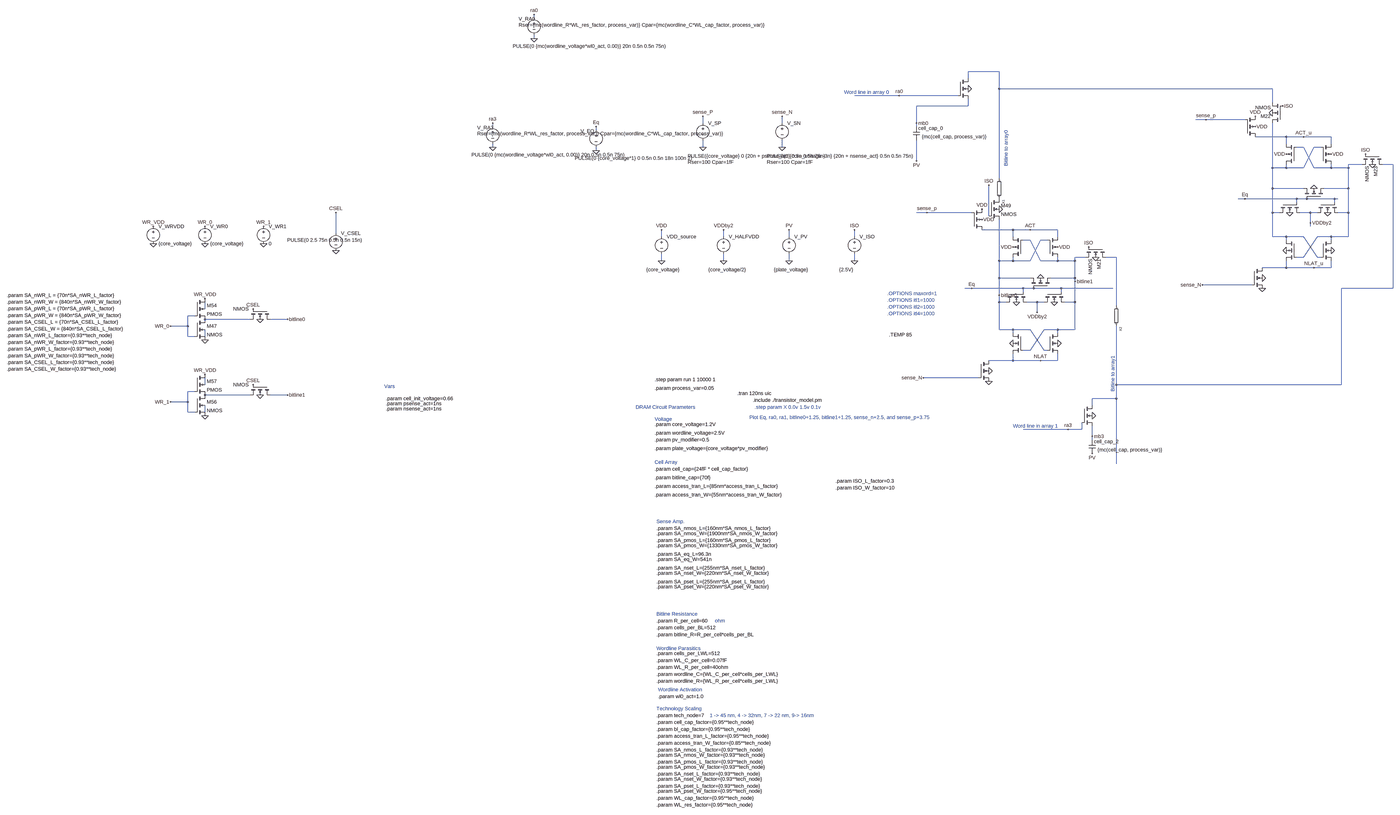
[diagram p0: schematic CLRDRAM-HP.asc, whole sheet]
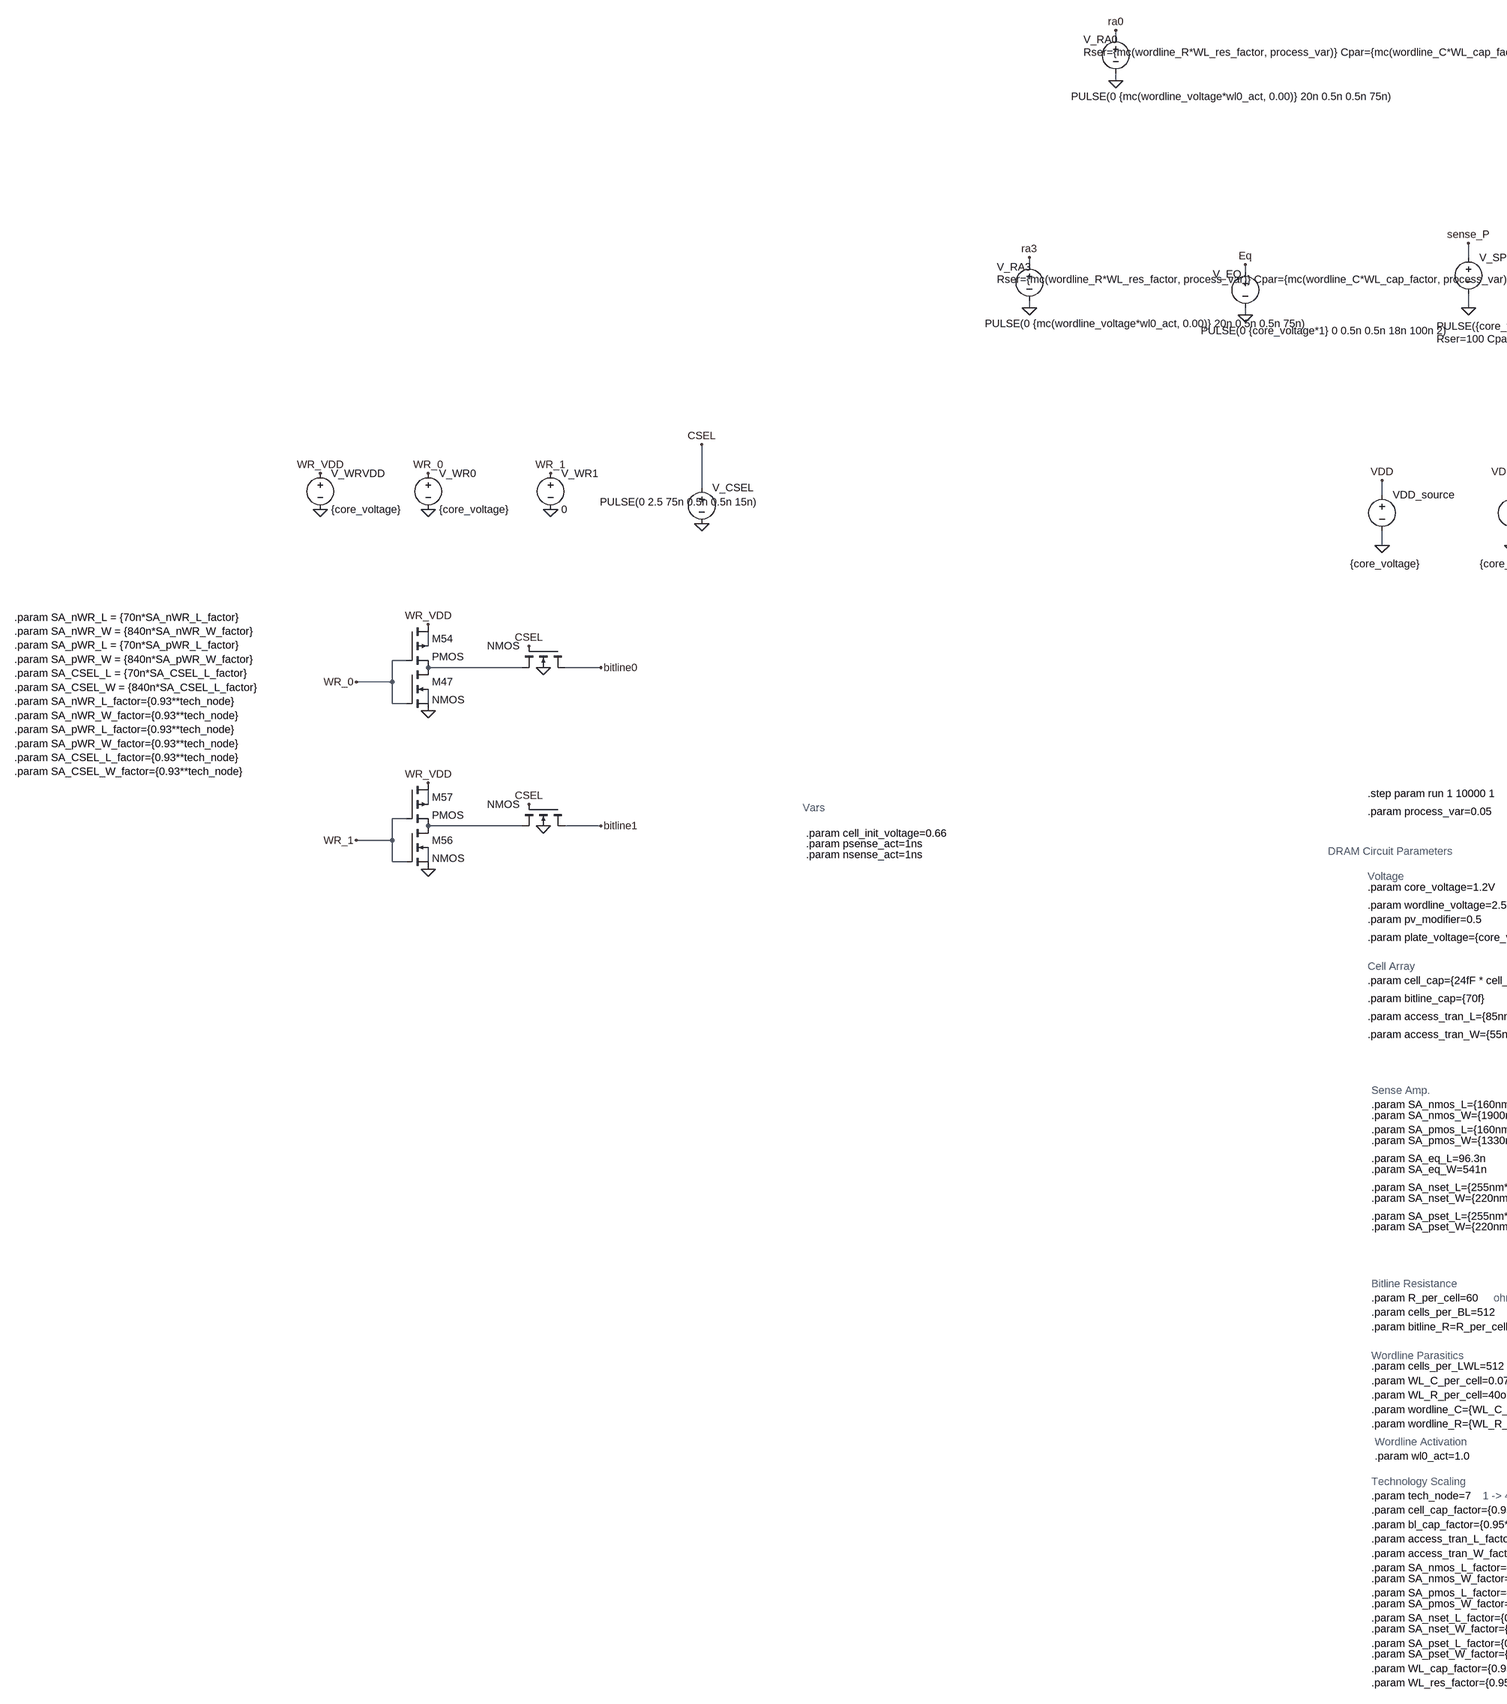
[diagram p1: schematic CLRDRAM-HP.asc, part, row 1 of 1, column 1 of 2]
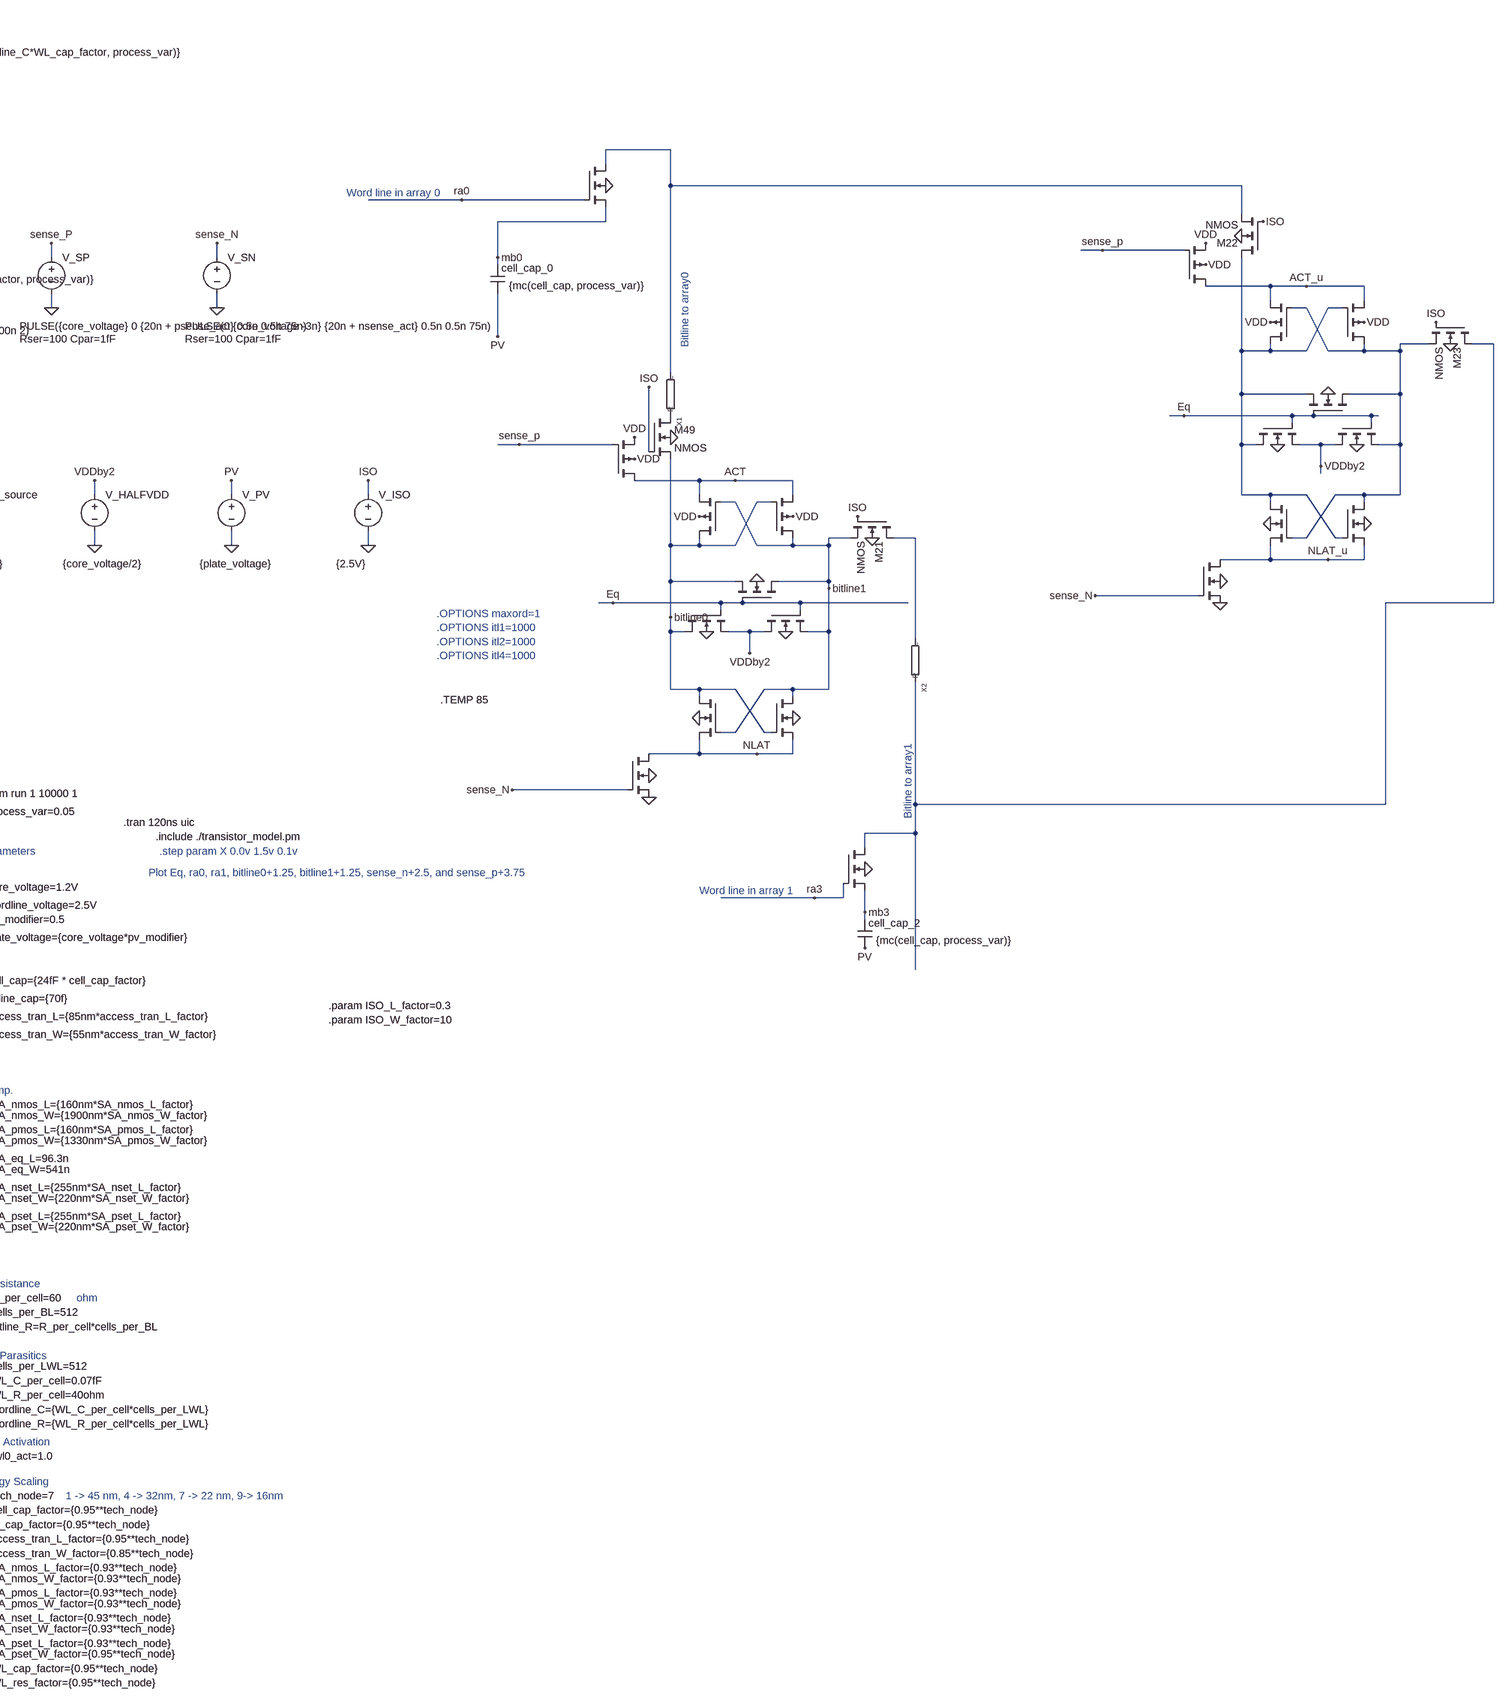
[diagram p2: schematic CLRDRAM-HP.asc, part, row 1 of 1, column 2 of 2]
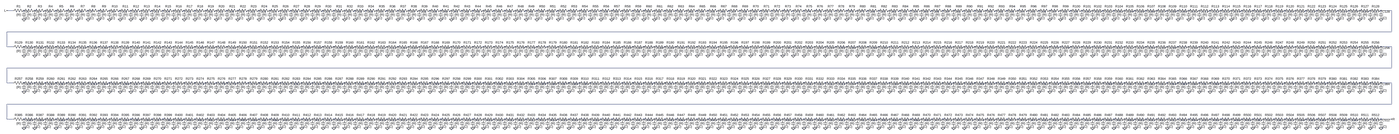
[diagram p3: sub-circuit bitline.asc, whole sheet]
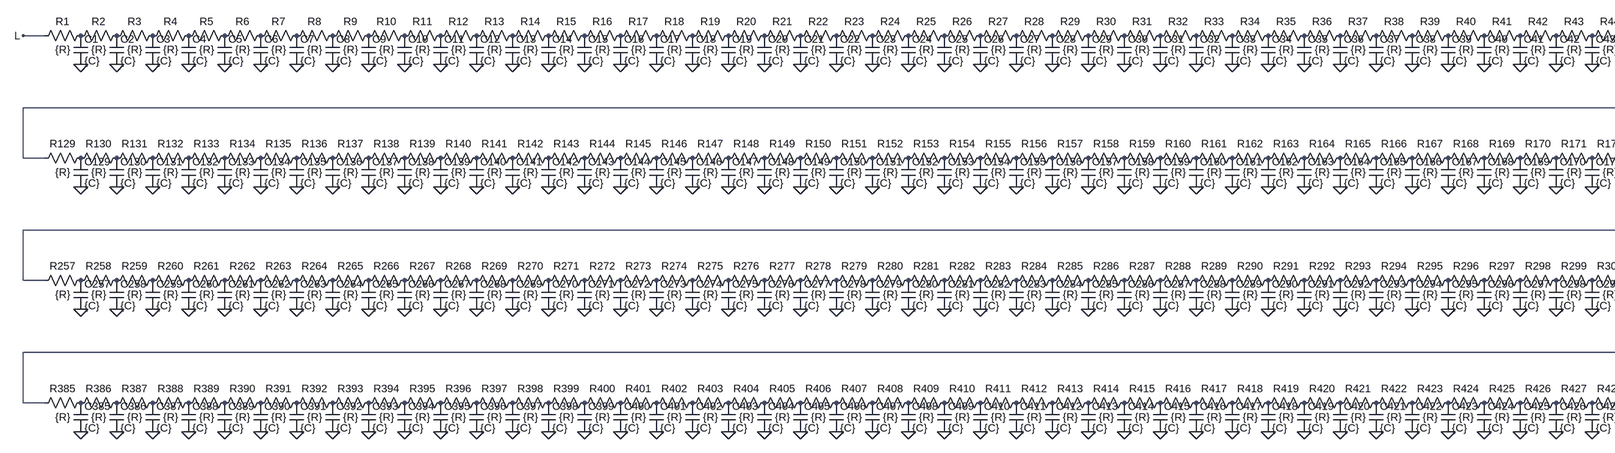
[diagram p4: sub-circuit bitline.asc, part, row 1 of 1, column 1 of 3]
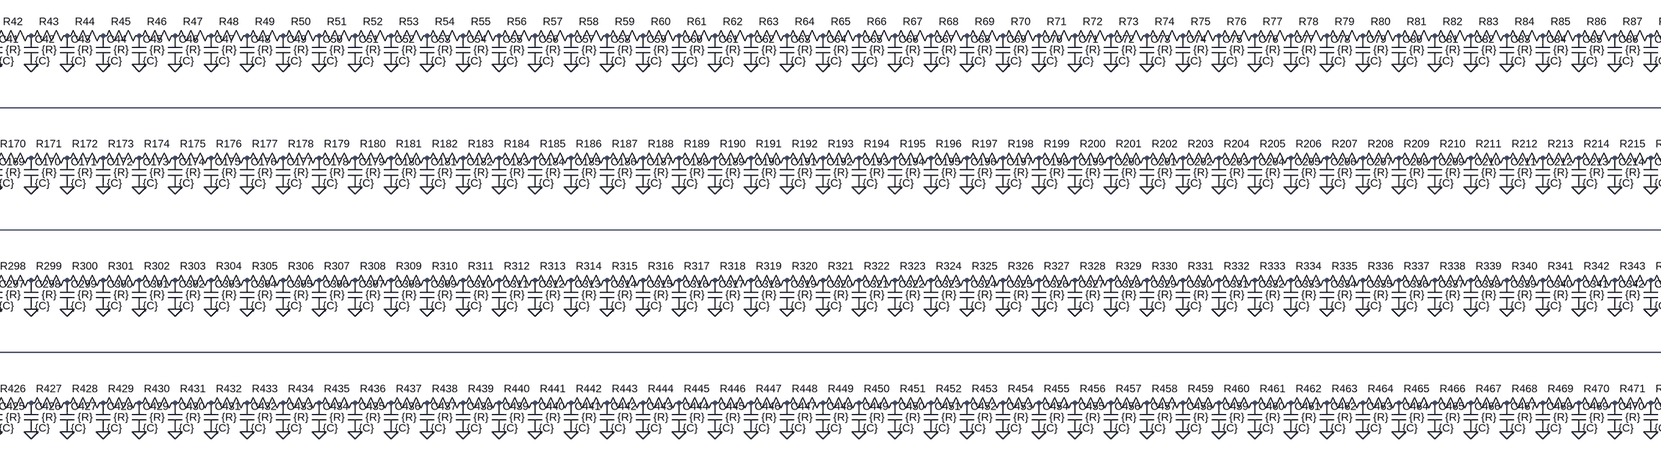
[diagram p5: sub-circuit bitline.asc, part, row 1 of 1, column 2 of 3]
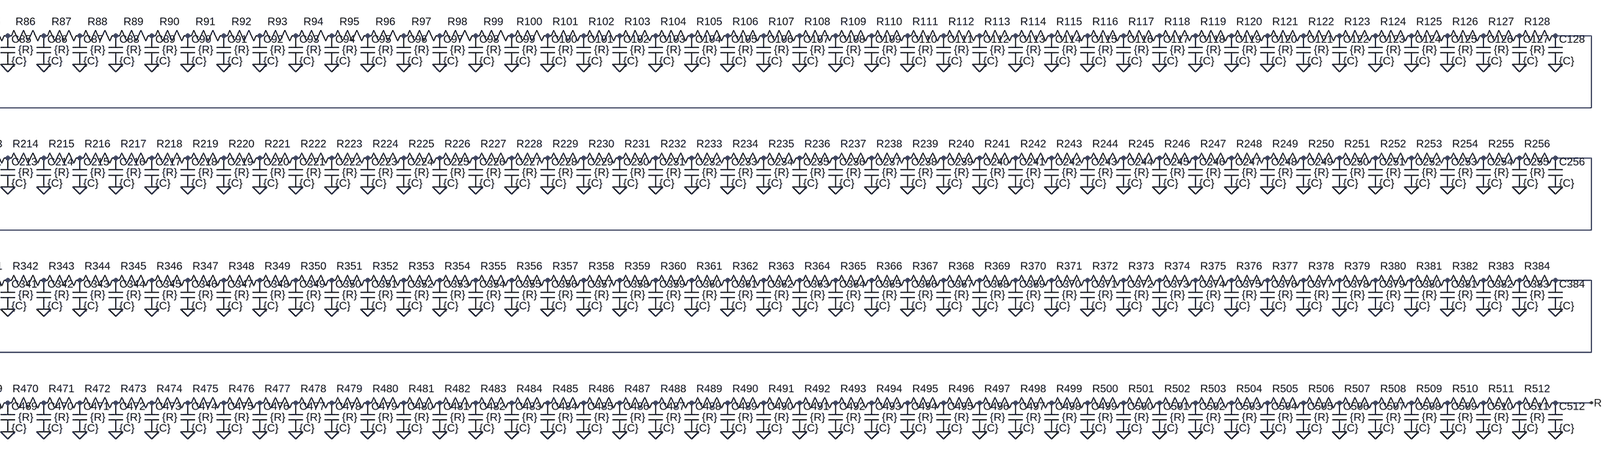
[diagram p6: sub-circuit bitline.asc, part, row 1 of 1, column 3 of 3]
CLRDRAM-HP.asc, the LTspice schematic file:
Version 4
SHEET 1 9124 2520
WIRE -1392 -1648 -1392 -1664
WIRE -1392 -1552 -1392 -1568
WIRE 768 -1392 624 -1392
WIRE 624 -1360 624 -1392
WIRE 768 -1312 768 -1392
WIRE 2064 -1312 768 -1312
WIRE 304 -1280 96 -1280
WIRE 576 -1280 304 -1280
WIRE 2064 -1248 2064 -1312
WIRE 624 -1232 624 -1264
WIRE 624 -1232 384 -1232
WIRE 1728 -1168 1680 -1168
WIRE 1936 -1168 1728 -1168
WIRE -608 -1152 -608 -1184
WIRE -240 -1152 -240 -1184
WIRE 384 -1152 384 -1232
WIRE -1584 -1136 -1584 -1152
WIRE 384 -1136 384 -1152
WIRE -1104 -1120 -1104 -1136
WIRE 2128 -1088 1984 -1088
WIRE 2208 -1088 2128 -1088
WIRE 2336 -1088 2208 -1088
WIRE 2128 -1056 2128 -1088
WIRE 2336 -1056 2336 -1088
WIRE -1584 -1040 -1584 -1056
WIRE -608 -1040 -608 -1072
WIRE -240 -1040 -240 -1072
WIRE 2208 -1040 2176 -1040
WIRE 2288 -1040 2256 -1040
WIRE -1104 -1024 -1104 -1040
WIRE 384 -976 384 -1072
WIRE 2480 -960 2416 -960
WIRE 2624 -960 2576 -960
WIRE 2064 -944 2064 -1152
WIRE 2128 -944 2128 -960
WIRE 2128 -944 2064 -944
WIRE 2208 -944 2256 -1040
WIRE 2208 -944 2128 -944
WIRE 2256 -944 2208 -1040
WIRE 2336 -944 2336 -960
WIRE 2336 -944 2256 -944
WIRE 2416 -944 2416 -960
WIRE 2416 -944 2336 -944
WIRE 768 -896 768 -1312
WIRE 2064 -848 2064 -944
WIRE 2208 -848 2064 -848
WIRE 2416 -848 2416 -944
WIRE 2416 -848 2304 -848
WIRE 1936 -800 1904 -800
WIRE 2176 -800 1936 -800
WIRE 2224 -800 2176 -800
WIRE 2352 -800 2224 -800
WIRE 2368 -800 2352 -800
WIRE 2176 -784 2176 -800
WIRE 2352 -784 2352 -800
WIRE 432 -736 384 -736
WIRE 640 -736 432 -736
WIRE 2064 -736 2064 -848
WIRE 2096 -736 2064 -736
WIRE 2240 -736 2192 -736
WIRE 2272 -736 2240 -736
WIRE 2416 -736 2416 -848
WIRE 2416 -736 2368 -736
WIRE 720 -720 720 -864
WIRE 2240 -688 2240 -736
WIRE 2240 -672 2240 -688
WIRE 832 -656 688 -656
WIRE 912 -656 832 -656
WIRE 1040 -656 912 -656
WIRE -3824 -640 -3824 -736
WIRE -800 -624 -800 -656
WIRE -512 -624 -512 -656
WIRE -208 -624 -208 -656
WIRE 96 -624 96 -656
WIRE 832 -624 832 -656
WIRE 1040 -624 1040 -656
WIRE 2064 -624 2064 -736
WIRE 2128 -624 2064 -624
WIRE 2208 -624 2128 -624
WIRE 2336 -624 2272 -624
WIRE 2416 -624 2416 -736
WIRE 2416 -624 2336 -624
WIRE 912 -608 880 -608
WIRE 992 -608 960 -608
WIRE 2128 -608 2128 -624
WIRE 2336 -608 2336 -624
WIRE 1168 -528 1120 -528
WIRE 1312 -528 1264 -528
WIRE 2208 -528 2272 -624
WIRE 2208 -528 2176 -528
WIRE 2272 -528 2208 -624
WIRE 2288 -528 2272 -528
WIRE -800 -512 -800 -544
WIRE -512 -512 -512 -544
WIRE -208 -512 -208 -544
WIRE 96 -512 96 -544
WIRE 768 -512 768 -704
WIRE 832 -512 832 -528
WIRE 832 -512 768 -512
WIRE 912 -512 960 -608
WIRE 912 -512 832 -512
WIRE 960 -512 912 -608
WIRE 1040 -512 1040 -528
WIRE 1040 -512 960 -512
WIRE 1120 -512 1120 -528
WIRE 1120 -512 1040 -512
WIRE 2128 -480 2128 -512
WIRE 2128 -480 2016 -480
WIRE 2256 -480 2128 -480
WIRE 2336 -480 2336 -512
WIRE 2336 -480 2256 -480
WIRE 768 -432 768 -512
WIRE 912 -432 768 -432
WIRE 1120 -432 1120 -512
WIRE 1120 -432 1008 -432
WIRE 1120 -416 1120 -432
WIRE 1968 -400 1712 -400
WIRE 640 -384 608 -384
WIRE 880 -384 640 -384
WIRE 928 -384 880 -384
WIRE 1056 -384 928 -384
WIRE 1296 -384 1056 -384
WIRE 2624 -384 2624 -960
WIRE 2624 -384 2384 -384
WIRE 880 -368 880 -384
WIRE 1056 -368 1056 -384
WIRE 768 -352 768 -432
WIRE 768 -320 768 -352
WIRE 800 -320 768 -320
WIRE 944 -320 896 -320
WIRE 976 -320 944 -320
WIRE 1120 -320 1120 -416
WIRE 1120 -320 1072 -320
WIRE 1312 -304 1312 -528
WIRE -4432 -288 -4432 -320
WIRE 944 -272 944 -320
WIRE -4480 -256 -4512 -256
WIRE -4224 -240 -4432 -240
WIRE -4048 -240 -4128 -240
WIRE -4512 -208 -4512 -256
WIRE -4512 -208 -4592 -208
WIRE 768 -192 768 -320
WIRE 832 -192 768 -192
WIRE 912 -192 832 -192
WIRE 1040 -192 976 -192
WIRE 1120 -192 1120 -320
WIRE 1120 -192 1040 -192
WIRE 832 -176 832 -192
WIRE 1040 -176 1040 -192
WIRE -4512 -160 -4512 -208
WIRE -4480 -160 -4512 -160
WIRE -4432 -160 -4432 -192
WIRE 912 -96 976 -192
WIRE 912 -96 880 -96
WIRE 976 -96 912 -192
WIRE 992 -96 976 -96
WIRE 832 -48 832 -80
WIRE 832 -48 720 -48
WIRE 960 -48 832 -48
WIRE 1040 -48 1040 -80
WIRE 1040 -48 960 -48
WIRE 672 32 416 32
WIRE -4432 64 -4432 32
WIRE 1312 64 1312 -208
WIRE 2384 64 2384 -384
WIRE 2384 64 1312 64
WIRE -4480 96 -4512 96
WIRE -4224 112 -4432 112
WIRE -4048 112 -4128 112
WIRE 1312 128 1312 64
WIRE 1312 128 1200 128
WIRE -4512 144 -4512 96
WIRE -4512 144 -4592 144
WIRE 1200 160 1200 128
WIRE -4512 192 -4512 144
WIRE -4480 192 -4512 192
WIRE -4432 192 -4432 160
WIRE 1088 272 880 272
WIRE 1152 272 1152 240
WIRE 1152 272 1088 272
WIRE 1200 304 1200 256
WIRE 1200 320 1200 304
WIRE 1312 432 1312 128
FLAG -1104 -1024 0
FLAG -1104 -1136 Eq
FLAG 720 0 0
FLAG -608 -1040 0
FLAG -608 -1184 sense_P
FLAG 1040 -128 0
FLAG 832 -128 0
FLAG 960 -432 0
FLAG 848 -320 0
FLAG 1024 -320 0
FLAG 640 -384 Eq
FLAG 944 -272 VDDby2
FLAG 416 32 sense_N
FLAG 720 48 0
FLAG 768 -352 bitline0
FLAG 1120 -416 bitline1
FLAG 624 -1312 0
FLAG 384 -1152 mb0
FLAG 304 -1280 ra0
FLAG 1200 208 0
FLAG 1200 304 mb3
FLAG 1088 272 ra3
FLAG -1392 -1552 0
FLAG -1392 -1664 ra0
FLAG 688 -704 VDD
FLAG 1040 -576 VDD
FLAG 832 -576 VDD
FLAG 688 -752 VDD
FLAG 432 -736 sense_p
FLAG 912 -656 ACT
FLAG 960 -48 NLAT
FLAG -240 -1040 0
FLAG -240 -1184 sense_N
FLAG -1584 -1152 ra3
FLAG -1584 -1040 0
FLAG -800 -512 0
FLAG -800 -656 VDD
FLAG -512 -512 0
FLAG -512 -656 VDDby2
FLAG 384 -976 PV
FLAG -208 -512 0
FLAG -208 -656 PV
FLAG 1200 384 PV
FLAG 2016 -432 0
FLAG 2336 -560 0
FLAG 2128 -560 0
FLAG 2256 -848 0
FLAG 2144 -736 0
FLAG 2320 -736 0
FLAG 1936 -800 Eq
FLAG 2240 -688 VDDby2
FLAG 1712 -400 sense_N
FLAG 2016 -384 0
FLAG 1984 -1136 VDD
FLAG 2336 -1008 VDD
FLAG 2128 -1008 VDD
FLAG 1984 -1184 VDD
FLAG 1728 -1168 sense_p
FLAG 2208 -1088 ACT_u
FLAG 2256 -480 NLAT_u
FLAG 96 -512 0
FLAG 96 -656 ISO
FLAG 768 -752 0
FLAG 1216 -528 0
FLAG 720 -864 ISO
FLAG 1184 -576 ISO
FLAG 2528 -960 0
FLAG 2496 -1008 ISO
FLAG 2064 -1200 0
FLAG 2112 -1232 ISO
FLAG -4432 -144 0
FLAG -4672 -592 0
FLAG -4672 -672 WR_VDD
FLAG -4432 -336 WR_VDD
FLAG -4592 -208 WR_0
FLAG -4432 -592 0
FLAG -4432 -672 WR_0
FLAG -4160 -592 0
FLAG -4160 -672 WR_1
FLAG -4176 -240 0
FLAG -4208 -288 CSEL
FLAG -4432 208 0
FLAG -4432 16 WR_VDD
FLAG -4592 144 WR_1
FLAG -4176 112 0
FLAG -4208 64 CSEL
FLAG -4048 -240 bitline0
FLAG -4048 112 bitline1
FLAG -3824 -560 0
FLAG -3824 -736 CSEL
SYMBOL nmos4 672 -48 R0
WINDOW 0 104 24 Invisible 2
WINDOW 3 179 41 Invisible 2
SYMATTR InstName M1
SYMATTR Value2 l={mc(SA_nset_L, process_var)} w={mc(SA_nset_W, process_var)}
SYMBOL voltage -1104 -1136 R0
WINDOW 0 -72 21 Left 2
WINDOW 3 -99 147 Left 2
WINDOW 123 0 0 Left 2
WINDOW 39 0 0 Left 2
SYMATTR InstName V_EQ
SYMATTR Value PULSE(0 {core_voltage*1} 0 0.5n 0.5n 18n 100n 2)
SYMBOL voltage -608 -1168 R0
WINDOW 123 0 0 Left 2
WINDOW 39 -71 197 Left 2
WINDOW 3 -71 169 Left 2
SYMATTR SpiceLine Rser=100 Cpar=1fF
SYMATTR Value PULSE({core_voltage} 0 {20n + psense_act} 0.5n 0.5n 75n)
SYMATTR InstName V_SP
SYMBOL nmos4 992 -176 R0
WINDOW 0 104 24 Invisible 2
WINDOW 3 179 41 Invisible 2
SYMATTR InstName M2
SYMATTR Value2 l={mc(SA_nmos_L,process_var)} w={mc(SA_nmos_W, process_var)}
SYMBOL nmos4 880 -176 M0
WINDOW 0 104 24 Invisible 2
WINDOW 3 179 41 Invisible 2
SYMATTR InstName M3
SYMATTR Value2 l={mc(SA_nmos_L,process_var)} w={mc(SA_nmos_W,process_var)}
SYMBOL nmos4 1008 -384 M270
WINDOW 0 104 24 Invisible 2
WINDOW 3 179 41 Invisible 2
SYMATTR InstName M4
SYMATTR Value2 l={mc(SA_eq_L,process_var)} w={mc(SA_eq_W, process_var)}
SYMBOL nmos4 800 -368 M90
WINDOW 0 104 24 Invisible 2
WINDOW 3 179 41 Invisible 2
SYMATTR InstName M5
SYMATTR Value2 l={mc(SA_eq_L,process_var)} w={mc(SA_eq_W,process_var)}
SYMBOL nmos4 976 -368 M90
WINDOW 0 104 24 Invisible 2
WINDOW 3 179 41 Invisible 2
SYMATTR InstName M6
SYMATTR Value2 l={mc(SA_eq_L,process_var)} w={mc(SA_eq_W,process_var)}
SYMBOL nmos4 576 -1360 R0
WINDOW 0 104 24 Invisible 2
WINDOW 3 179 41 Invisible 2
SYMATTR InstName M7
SYMATTR Value nmoslp
SYMATTR Value2 l={mc(access_tran_L,process_var)} w={mc(access_tran_W,process_var)}
SYMBOL cap 368 -1136 R0
WINDOW 3 41 47 Left 2
SYMATTR Value {mc(cell_cap, process_var)}
SYMATTR InstName cell_cap_0
SYMATTR SpiceLine IC={-plate_voltage + {cell_init_voltage}}
SYMBOL nmos4 1152 160 R0
WINDOW 0 104 24 Invisible 2
WINDOW 3 179 41 Invisible 2
SYMATTR InstName M8
SYMATTR Value nmoslp
SYMATTR Value2 l={mc(access_tran_L,process_var)} w={mc(access_tran_W,process_var)}
SYMBOL cap 1184 320 R0
WINDOW 3 41 47 Left 2
SYMATTR Value {mc(cell_cap, process_var)}
SYMATTR InstName cell_cap_2
SYMATTR SpiceLine IC={-plate_voltage + 0.02*1.2}
SYMBOL voltage -1392 -1664 R0
WINDOW 0 -72 21 Left 2
WINDOW 3 -99 147 Left 2
WINDOW 123 0 0 Left 2
WINDOW 39 -72 49 Left 2
SYMATTR InstName V_RA0
SYMATTR Value PULSE(0 {mc(wordline_voltage*wl0_act, 0.00)} 20n 0.5n 0.5n 75n)
SYMATTR SpiceLine Rser={mc(wordline_R*WL_res_factor, process_var)} Cpar={mc(wordline_C*WL_cap_factor, process_var)}
SYMBOL pmos4 640 -656 M180
WINDOW 0 56 32 Invisible 2
WINDOW 3 56 72 Invisible 2
SYMATTR InstName M9
SYMATTR Value2 l={mc(SA_pset_L, process_var)} w={mc(SA_pset_W, process_var)}
SYMBOL pmos4 992 -528 M180
WINDOW 0 56 32 Invisible 2
WINDOW 3 56 72 Invisible 2
SYMATTR InstName M10
SYMATTR Value2 l={mc(SA_pmos_L, process_var)} w={mc(SA_pmos_W,process_var)}
SYMBOL pmos4 880 -528 R180
WINDOW 0 56 32 Invisible 2
WINDOW 3 56 72 Invisible 2
SYMATTR InstName M11
SYMATTR Value2 l={mc(SA_pmos_L, process_var)} w={mc(SA_pmos_W, process_var)}
SYMBOL voltage -240 -1168 R0
WINDOW 123 0 0 Left 2
WINDOW 39 -71 197 Left 2
WINDOW 3 -71 169 Left 2
SYMATTR SpiceLine Rser=100 Cpar=1fF
SYMATTR Value PULSE(0 {core_voltage -3n} {20n + nsense_act} 0.5n 0.5n 75n)
SYMATTR InstName V_SN
SYMBOL voltage -1584 -1152 R0
WINDOW 0 -72 21 Left 2
WINDOW 3 -99 147 Left 2
WINDOW 123 0 0 Left 2
WINDOW 39 -72 49 Left 2
SYMATTR InstName V_RA3
SYMATTR Value PULSE(0 {mc(wordline_voltage*wl0_act, 0.00)} 20n 0.5n 0.5n 75n)
SYMATTR SpiceLine Rser={mc(wordline_R*WL_res_factor, process_var)} Cpar={mc(wordline_C*WL_cap_factor, process_var)}
SYMBOL voltage -800 -640 R0
WINDOW 123 0 0 Left 2
WINDOW 39 -71 197 Left 2
WINDOW 3 -71 169 Left 2
SYMATTR Value {core_voltage}
SYMATTR InstName VDD_source
SYMBOL voltage -512 -640 R0
WINDOW 123 0 0 Left 2
WINDOW 39 -71 197 Left 2
WINDOW 3 -71 169 Left 2
SYMATTR Value {core_voltage/2}
SYMATTR InstName V_HALFVDD
SYMBOL voltage -208 -640 R0
WINDOW 123 0 0 Left 2
WINDOW 39 -71 197 Left 2
WINDOW 3 -71 169 Left 2
SYMATTR Value {plate_voltage}
SYMATTR InstName V_PV
SYMBOL nmos4 1968 -480 R0
WINDOW 0 104 24 Invisible 2
WINDOW 3 179 41 Invisible 2
SYMATTR InstName M12
SYMATTR Value2 l={mc(SA_nset_L, process_var)} w={mc(SA_nset_W, process_var)}
SYMBOL nmos4 2288 -608 R0
WINDOW 0 104 24 Invisible 2
WINDOW 3 179 41 Invisible 2
SYMATTR InstName M13
SYMATTR Value2 l={mc(SA_nmos_L,process_var)} w={mc(SA_nmos_W, process_var)}
SYMBOL nmos4 2176 -608 M0
WINDOW 0 104 24 Invisible 2
WINDOW 3 179 41 Invisible 2
SYMATTR InstName M14
SYMATTR Value2 l={mc(SA_nmos_L,process_var)} w={mc(SA_nmos_W,process_var)}
SYMBOL nmos4 2304 -800 M270
WINDOW 0 104 24 Invisible 2
WINDOW 3 179 41 Invisible 2
SYMATTR InstName M15
SYMATTR Value2 l={mc(SA_eq_L,process_var)} w={mc(SA_eq_W, process_var)}
SYMBOL nmos4 2096 -784 M90
WINDOW 0 104 24 Invisible 2
WINDOW 3 179 41 Invisible 2
SYMATTR InstName M16
SYMATTR Value2 l={mc(SA_eq_L,process_var)} w={mc(SA_eq_W,process_var)}
SYMBOL nmos4 2272 -784 M90
WINDOW 0 104 24 Invisible 2
WINDOW 3 179 41 Invisible 2
SYMATTR InstName M17
SYMATTR Value2 l={mc(SA_eq_L,process_var)} w={mc(SA_eq_W,process_var)}
SYMBOL pmos4 1936 -1088 M180
WINDOW 0 56 32 Invisible 2
WINDOW 3 56 72 Invisible 2
SYMATTR InstName M18
SYMATTR Value2 l={mc(SA_pset_L, process_var)} w={mc(SA_pset_W, process_var)}
SYMBOL pmos4 2288 -960 M180
WINDOW 0 56 32 Invisible 2
WINDOW 3 56 72 Invisible 2
SYMATTR InstName M19
SYMATTR Value2 l={mc(SA_pmos_L, process_var)} w={mc(SA_pmos_W,process_var)}
SYMBOL pmos4 2176 -960 R180
WINDOW 0 56 32 Invisible 2
WINDOW 3 56 72 Invisible 2
SYMATTR InstName M20
SYMATTR Value2 l={mc(SA_pmos_L, process_var)} w={mc(SA_pmos_W, process_var)}
SYMBOL voltage 96 -640 R0
WINDOW 123 0 0 Left 2
WINDOW 39 -71 197 Left 2
WINDOW 3 -71 169 Left 2
SYMATTR Value {2.5V}
SYMATTR InstName V_ISO
SYMBOL bitline 768 -848 R90
SYMATTR InstName X1
SYMATTR SpiceLine R={mc(40,0.05)} C={mc(bitline_cap / 512, 0.05)}
SYMBOL bitline 1312 -256 R90
SYMATTR InstName X2
SYMATTR SpiceLine R={mc(40,0.05)} C={mc(bitline_cap / 512, 0.05)}
SYMBOL nmos4 720 -800 R0
SYMATTR InstName M49
SYMATTR Value2 l={mc(SA_nmos_L * ISO_L_factor, 0.05)} w={mc(SA_nmos_W / ISO_W_factor, 0.05)}
SYMBOL nmos4 -4480 -240 R0
SYMATTR InstName M47
SYMATTR Value2 l={mc(SA_nWR_L, process_var)} w={mc(SA_nWR_W, process_var)}
SYMBOL pmos4 -4480 -336 R0
SYMATTR InstName M54
SYMATTR Value2 l={mc(SA_pWR_L, process_var)} w={mc(SA_pWR_W, process_var)}
SYMBOL voltage -4672 -688 R0
WINDOW 123 0 0 Left 0
WINDOW 39 0 0 Left 0
SYMATTR InstName V_WRVDD
SYMATTR Value {core_voltage}
SYMBOL voltage -4432 -688 R0
WINDOW 123 0 0 Left 0
WINDOW 39 0 0 Left 0
SYMATTR InstName V_WR0
SYMATTR Value {core_voltage}
SYMBOL voltage -4160 -688 R0
WINDOW 123 0 0 Left 0
WINDOW 39 0 0 Left 0
SYMATTR InstName V_WR1
SYMATTR Value 0
SYMBOL nmos4 -4128 -288 R90
WINDOW 0 56 32 Invisible 2
WINDOW 3 0 101 VRight 2
SYMATTR InstName M55
SYMATTR Value2 l={mc(SA_CSEL_L, process_var)} w={mc(SA_CSEL_W, process_var)}
SYMBOL nmos4 -4480 112 R0
SYMATTR InstName M56
SYMATTR Value2 l={mc(SA_nWR_L, process_var)} w={mc(SA_nWR_W, process_var)}
SYMBOL pmos4 -4480 16 R0
SYMATTR InstName M57
SYMATTR Value2 l={mc(SA_pWR_L, process_var)} w={mc(SA_pWR_W, process_var)}
SYMBOL nmos4 -4128 64 R90
WINDOW 0 56 32 Invisible 2
WINDOW 3 0 101 VRight 2
SYMATTR InstName M58
SYMATTR Value2 l={mc(SA_CSEL_L, process_var)} w={mc(SA_CSEL_W, process_var)}
SYMBOL voltage -3824 -656 R0
WINDOW 123 0 0 Left 2
WINDOW 39 -71 197 Left 2
WINDOW 3 -226 48 Left 2
SYMATTR Value PULSE(0 2.5 75n 0.5n 0.5n 15n)
SYMATTR InstName V_CSEL
SYMBOL nmos4 1264 -576 R90
SYMATTR InstName M21
SYMATTR Value2 l={mc(SA_nmos_L * ISO_L_factor, 0.05)} w={mc(SA_nmos_W / ISO_W_factor, 0.05)}
SYMBOL nmos4 2112 -1152 R180
SYMATTR InstName M22
SYMATTR Value2 l={mc(SA_nmos_L * ISO_L_factor, 0.05)} w={mc(SA_nmos_W / ISO_W_factor, 0.05)}
SYMBOL nmos4 2576 -1008 R90
SYMATTR InstName M23
SYMATTR Value2 l={mc(SA_nmos_L * ISO_L_factor, 0.05)} w={mc(SA_nmos_W / ISO_W_factor, 0.05)}
TEXT -376 136 Left 2 !.include ./transistor_model.pm
TEXT 800 -952 VLeft 2 ;Bitline to array0
TEXT 1296 96 VLeft 2 ;Bitline to array1
TEXT -448 104 Left 2 !.tran 120ns uic
TEXT -392 216 Left 2 ;Plot Eq, ra0, ra1, bitline0+1.25, bitline1+1.25, sense_n+2.5, and sense_p+3.75
TEXT 48 -1296 Left 2 ;Word line in array 0
TEXT 832 256 Left 2 ;Word line in array 1
TEXT -368 168 Left 2 ;.step param X 0.0v 1.5v 0.1v
TEXT -832 80 Left 2 !.param process_var=0.05
TEXT -832 40 Left 2 !.step param run 1 10000 1
TEXT -832 456 Left 2 !.param cell_cap={24fF * cell_cap_factor}
TEXT -832 496 Left 2 !.param bitline_cap={70f}
TEXT -920 168 Left 2 ;DRAM Circuit Parameters
TEXT -832 536 Left 2 !.param access_tran_L={85nm*access_tran_L_factor}
TEXT -832 576 Left 2 !.param access_tran_W={55nm*access_tran_W_factor}
TEXT -824 1264 Left 2 !.param bitline_R=R_per_cell*cells_per_BL
TEXT -552 1200 Left 2 ;ohm
TEXT -824 1200 Left 2 !.param R_per_cell=60
TEXT -824 1168 Left 2 ;Bitline Resistance
TEXT -824 760 Left 2 !.param SA_nmos_L={160nm*SA_nmos_L_factor}
TEXT -824 784 Left 2 !.param SA_nmos_W={1900nm*SA_nmos_W_factor}
TEXT -824 816 Left 2 !.param SA_pmos_L={160nm*SA_pmos_L_factor}
TEXT -824 840 Left 2 !.param SA_pmos_W={1330nm*SA_pmos_W_factor}
TEXT -824 880 Left 2 !.param SA_eq_L=96.3n
TEXT -824 904 Left 2 !.param SA_eq_W=541n
TEXT -824 944 Left 2 !.param SA_nset_L={255nm*SA_nset_L_factor}
TEXT -824 968 Left 2 !.param SA_nset_W={220nm*SA_nset_W_factor}
TEXT -824 1008 Left 2 !.param SA_pset_L={255nm*SA_pset_L_factor}
TEXT -824 1032 Left 2 !.param SA_pset_W={220nm*SA_pset_W_factor}
TEXT -824 1232 Left 2 !.param cells_per_BL=512
TEXT -832 424 Left 2 ;Cell Array
TEXT -824 728 Left 2 ;Sense Amp.
TEXT -832 224 Left 2 ;Voltage
TEXT -832 248 Left 2 !.param core_voltage=1.2V
TEXT -832 288 Left 2 !.param wordline_voltage=2.5V
TEXT -832 320 Left 2 !.param pv_modifier=0.5
TEXT -832 360 Left 2 !.param plate_voltage={core_voltage*pv_modifier}
TEXT -2080 152 Left 2 !.param psense_act=1ns 
TEXT -2080 176 Left 2 !.param nsense_act=1ns 
TEXT -816 1520 Left 2 ;Wordline Activation
TEXT -816 1552 Left 2 !.param wl0_act=1.0
TEXT -824 1640 Left 2 !.param tech_node=7
TEXT -576 1640 Left 2 ;1 -> 45 nm, 4 -> 32nm, 7 -> 22 nm, 9-> 16nm
TEXT -824 1608 Left 2 ;Technology Scaling
TEXT -824 1672 Left 2 !.param cell_cap_factor={0.95**tech_node}
TEXT -824 1704 Left 2 !.param bl_cap_factor={0.95**tech_node}
TEXT -824 1736 Left 2 !.param access_tran_L_factor={0.95**tech_node}
TEXT -824 1768 Left 2 !.param access_tran_W_factor={0.85**tech_node}
TEXT -824 1800 Left 2 !.param SA_nmos_L_factor={0.93**tech_node}
TEXT -824 1824 Left 2 !.param SA_nmos_W_factor={0.93**tech_node}
TEXT -824 1856 Left 2 !.param SA_pmos_L_factor={0.93**tech_node}
TEXT -824 1880 Left 2 !.param SA_pmos_W_factor={0.93**tech_node}
TEXT -824 1912 Left 2 !.param SA_nset_L_factor={0.93**tech_node}
TEXT -824 1936 Left 2 !.param SA_nset_W_factor={0.93**tech_node}
TEXT -824 1968 Left 2 !.param SA_pset_L_factor={0.93**tech_node}
TEXT -824 1992 Left 2 !.param SA_pset_W_factor={0.95**tech_node}
TEXT -824 1448 Left 2 !.param wordline_C={WL_C_per_cell*cells_per_LWL}
TEXT -824 1384 Left 2 !.param WL_C_per_cell=0.07fF
TEXT -824 1328 Left 2 ;Wordline Parasitics
TEXT -824 1352 Left 2 !.param cells_per_LWL=512
TEXT -824 1416 Left 2 !.param WL_R_per_cell=40ohm
TEXT -824 1480 Left 2 !.param wordline_R={WL_R_per_cell*cells_per_LWL}
TEXT -824 2024 Left 2 !.param WL_cap_factor={0.95**tech_node}
TEXT -824 2056 Left 2 !.param WL_res_factor={0.95**tech_node}
TEXT 248 -360 Left 2 ;.OPTIONS maxord=1\n.OPTIONS itl1=1000\n.OPTIONS itl2=1000\n.OPTIONS itl4=1000
TEXT 256 -168 Left 2 !.TEMP 85
TEXT -5352 -352 Left 2 !.param SA_nWR_L = {70n*SA_nWR_L_factor}\n.param SA_nWR_W = {840n*SA_nWR_W_factor}\n.param SA_pWR_L = {70n*SA_pWR_L_factor}\n.param SA_pWR_W = {840n*SA_pWR_W_factor}\n.param SA_CSEL_L = {70n*SA_CSEL_L_factor}\n.param SA_CSEL_W = {840n*SA_CSEL_L_factor}\n.param SA_nWR_L_factor={0.93**tech_node}\n.param SA_nWR_W_factor={0.93**tech_node}\n.param SA_pWR_L_factor={0.93**tech_node}\n.param SA_pWR_W_factor={0.93**tech_node}\n.param SA_CSEL_L_factor={0.93**tech_node}\n.param SA_CSEL_W_factor={0.93**tech_node}
TEXT 8 512 Left 2 !.param ISO_L_factor=0.3\n.param ISO_W_factor=10
TEXT -2088 72 Left 2 ;Vars
TEXT -2080 128 Left 2 !.param cell_init_voltage=0.66

The netlist it stands for:
* CLRDRAM-HP.asc
M1 NLAT sense_N 0 0 NMOS l={mc(SA_nset_L, process_var)} w={mc(SA_nset_W, process_var)}
V_EQ Eq 0 PULSE(0 {core_voltage*1} 0 0.5n 0.5n 18n 100n 2)
V_SP sense_P 0 PULSE({core_voltage} 0 {20n + psense_act} 0.5n 0.5n 75n) Rser=100 Cpar=1fF
M2 bitline1 bitline0 NLAT 0 NMOS l={mc(SA_nmos_L,process_var)} w={mc(SA_nmos_W, process_var)}
M3 bitline0 bitline1 NLAT 0 NMOS l={mc(SA_nmos_L,process_var)} w={mc(SA_nmos_W,process_var)}
M4 bitline1 Eq bitline0 0 NMOS l={mc(SA_eq_L,process_var)} w={mc(SA_eq_W, process_var)}
M5 bitline0 Eq VDDby2 0 NMOS l={mc(SA_eq_L,process_var)} w={mc(SA_eq_W,process_var)}
M6 VDDby2 Eq bitline1 0 NMOS l={mc(SA_eq_L,process_var)} w={mc(SA_eq_W,process_var)}
M7 N001 ra0 mb0 0 nmoslp l={mc(access_tran_L,process_var)} w={mc(access_tran_W,process_var)}
cell_cap_0 mb0 PV {mc(cell_cap, process_var)} IC={-plate_voltage + {cell_init_voltage}}
M8 N004 ra3 mb3 0 nmoslp l={mc(access_tran_L,process_var)} w={mc(access_tran_W,process_var)}
cell_cap_2 mb3 PV {mc(cell_cap, process_var)} IC={-plate_voltage + 0.02*1.2}
V_RA0 ra0 0 PULSE(0 {mc(wordline_voltage*wl0_act, 0.00)} 20n 0.5n 0.5n 75n) Rser={mc(wordline_R*WL_res_factor, process_var)} Cpar={mc(wordline_C*WL_cap_factor, process_var)}
M9 ACT sense_P VDD VDD PMOS l={mc(SA_pset_L, process_var)} w={mc(SA_pset_W, process_var)}
M10 bitline1 bitline0 ACT VDD PMOS l={mc(SA_pmos_L, process_var)} w={mc(SA_pmos_W,process_var)}
M11 bitline0 bitline1 ACT VDD PMOS l={mc(SA_pmos_L, process_var)} w={mc(SA_pmos_W, process_var)}
V_SN sense_N 0 PULSE(0 {core_voltage -3n} {20n + nsense_act} 0.5n 0.5n 75n) Rser=100 Cpar=1fF
V_RA3 ra3 0 PULSE(0 {mc(wordline_voltage*wl0_act, 0.00)} 20n 0.5n 0.5n 75n) Rser={mc(wordline_R*WL_res_factor, process_var)} Cpar={mc(wordline_C*WL_cap_factor, process_var)}
VDD_source VDD 0 {core_voltage}
V_HALFVDD VDDby2 0 {core_voltage/2}
V_PV PV 0 {plate_voltage}
M12 NLAT_u sense_N 0 0 NMOS l={mc(SA_nset_L, process_var)} w={mc(SA_nset_W, process_var)}
M13 N002 N003 NLAT_u 0 NMOS l={mc(SA_nmos_L,process_var)} w={mc(SA_nmos_W, process_var)}
M14 N003 N002 NLAT_u 0 NMOS l={mc(SA_nmos_L,process_var)} w={mc(SA_nmos_W,process_var)}
M15 N002 Eq N003 0 NMOS l={mc(SA_eq_L,process_var)} w={mc(SA_eq_W, process_var)}
M16 N003 Eq VDDby2 0 NMOS l={mc(SA_eq_L,process_var)} w={mc(SA_eq_W,process_var)}
M17 VDDby2 Eq N002 0 NMOS l={mc(SA_eq_L,process_var)} w={mc(SA_eq_W,process_var)}
M18 ACT_u sense_P VDD VDD PMOS l={mc(SA_pset_L, process_var)} w={mc(SA_pset_W, process_var)}
M19 N002 N003 ACT_u VDD PMOS l={mc(SA_pmos_L, process_var)} w={mc(SA_pmos_W,process_var)}
M20 N003 N002 ACT_u VDD PMOS l={mc(SA_pmos_L, process_var)} w={mc(SA_pmos_W, process_var)}
V_ISO ISO 0 {2.5V}
XX1 N001 P001 bitline params: R={mc(40,0.05)} C={mc(bitline_cap / 512, 0.05)}
XX2 N005 N004 bitline params: R={mc(40,0.05)} C={mc(bitline_cap / 512, 0.05)}
M49 P001 ISO bitline0 0 NMOS l={mc(SA_nmos_L * ISO_L_factor, 0.05)} w={mc(SA_nmos_W / ISO_W_factor, 0.05)}
M47 N007 WR_0 0 N008 NMOS l={mc(SA_nWR_L, process_var)} w={mc(SA_nWR_W, process_var)}
M54 WR_VDD WR_0 N007 N006 PMOS l={mc(SA_pWR_L, process_var)} w={mc(SA_pWR_W, process_var)}
V_WRVDD WR_VDD 0 {core_voltage}
V_WR0 WR_0 0 {core_voltage}
V_WR1 WR_1 0 0
M55 bitline0 CSEL N007 0 NMOS l={mc(SA_CSEL_L, process_var)} w={mc(SA_CSEL_W, process_var)}
M56 N010 WR_1 0 N011 NMOS l={mc(SA_nWR_L, process_var)} w={mc(SA_nWR_W, process_var)}
M57 WR_VDD WR_1 N010 N009 PMOS l={mc(SA_pWR_L, process_var)} w={mc(SA_pWR_W, process_var)}
M58 bitline1 CSEL N010 0 NMOS l={mc(SA_CSEL_L, process_var)} w={mc(SA_CSEL_W, process_var)}
V_CSEL CSEL 0 PULSE(0 2.5 75n 0.5n 0.5n 15n)
M21 N005 ISO bitline1 0 NMOS l={mc(SA_nmos_L * ISO_L_factor, 0.05)} w={mc(SA_nmos_W / ISO_W_factor, 0.05)}
M22 N003 ISO N001 0 NMOS l={mc(SA_nmos_L * ISO_L_factor, 0.05)} w={mc(SA_nmos_W / ISO_W_factor, 0.05)}
M23 N004 ISO N002 0 NMOS l={mc(SA_nmos_L * ISO_L_factor, 0.05)} w={mc(SA_nmos_W / ISO_W_factor, 0.05)}

* block symbol definitions
.subckt bitline L R
R1 P001 L {R}
C1 P001 0 {C}
R2 P002 P001 {R}
C2 P002 0 {C}
R3 P003 P002 {R}
C3 P003 0 {C}
R4 P004 P003 {R}
C4 P004 0 {C}
R5 P005 P004 {R}
C5 P005 0 {C}
R6 P006 P005 {R}
C6 P006 0 {C}
R7 P007 P006 {R}
C7 P007 0 {C}
R8 P008 P007 {R}
C8 P008 0 {C}
R9 P009 P008 {R}
C9 P009 0 {C}
R10 P010 P009 {R}
C10 P010 0 {C}
R11 P011 P010 {R}
C11 P011 0 {C}
R12 P012 P011 {R}
C12 P012 0 {C}
R13 P013 P012 {R}
C13 P013 0 {C}
R14 P014 P013 {R}
C14 P014 0 {C}
R15 P015 P014 {R}
C15 P015 0 {C}
R16 P016 P015 {R}
C16 P016 0 {C}
R17 P017 P016 {R}
C17 P017 0 {C}
R18 P018 P017 {R}
C18 P018 0 {C}
R19 P019 P018 {R}
C19 P019 0 {C}
R20 P020 P019 {R}
C20 P020 0 {C}
R21 P021 P020 {R}
C21 P021 0 {C}
R22 P022 P021 {R}
C22 P022 0 {C}
R23 P023 P022 {R}
C23 P023 0 {C}
R24 P024 P023 {R}
C24 P024 0 {C}
R25 P025 P024 {R}
C25 P025 0 {C}
R26 P026 P025 {R}
C26 P026 0 {C}
R27 P027 P026 {R}
C27 P027 0 {C}
R28 P028 P027 {R}
C28 P028 0 {C}
R29 P029 P028 {R}
C29 P029 0 {C}
R30 P030 P029 {R}
C30 P030 0 {C}
R31 P031 P030 {R}
C31 P031 0 {C}
R32 P032 P031 {R}
C32 P032 0 {C}
R33 P033 P032 {R}
C33 P033 0 {C}
R34 P034 P033 {R}
C34 P034 0 {C}
R35 P035 P034 {R}
C35 P035 0 {C}
R36 P036 P035 {R}
C36 P036 0 {C}
R37 P037 P036 {R}
C37 P037 0 {C}
R38 P038 P037 {R}
C38 P038 0 {C}
R39 P039 P038 {R}
C39 P039 0 {C}
R40 P040 P039 {R}
C40 P040 0 {C}
R41 P041 P040 {R}
C41 P041 0 {C}
R42 P042 P041 {R}
C42 P042 0 {C}
R43 P043 P042 {R}
C43 P043 0 {C}
R44 P044 P043 {R}
C44 P044 0 {C}
R45 P045 P044 {R}
C45 P045 0 {C}
R46 P046 P045 {R}
C46 P046 0 {C}
R47 P047 P046 {R}
C47 P047 0 {C}
R48 P048 P047 {R}
C48 P048 0 {C}
R49 P049 P048 {R}
C49 P049 0 {C}
R50 P050 P049 {R}
C50 P050 0 {C}
R51 P051 P050 {R}
C51 P051 0 {C}
R52 P052 P051 {R}
C52 P052 0 {C}
R53 P053 P052 {R}
C53 P053 0 {C}
R54 P054 P053 {R}
C54 P054 0 {C}
R55 P055 P054 {R}
C55 P055 0 {C}
R56 P056 P055 {R}
C56 P056 0 {C}
R57 P057 P056 {R}
C57 P057 0 {C}
R58 P058 P057 {R}
C58 P058 0 {C}
R59 P059 P058 {R}
C59 P059 0 {C}
R60 P060 P059 {R}
C60 P060 0 {C}
R61 P061 P060 {R}
C61 P061 0 {C}
R62 P062 P061 {R}
C62 P062 0 {C}
R63 P063 P062 {R}
C63 P063 0 {C}
R64 P064 P063 {R}
C64 P064 0 {C}
R65 P065 P064 {R}
C65 P065 0 {C}
R66 P066 P065 {R}
C66 P066 0 {C}
R67 P067 P066 {R}
C67 P067 0 {C}
R68 P068 P067 {R}
C68 P068 0 {C}
R69 P069 P068 {R}
C69 P069 0 {C}
R70 P070 P069 {R}
C70 P070 0 {C}
R71 P071 P070 {R}
C71 P071 0 {C}
R72 P072 P071 {R}
C72 P072 0 {C}
R73 P073 P072 {R}
C73 P073 0 {C}
R74 P074 P073 {R}
C74 P074 0 {C}
R75 P075 P074 {R}
C75 P075 0 {C}
R76 P076 P075 {R}
C76 P076 0 {C}
R77 P077 P076 {R}
C77 P077 0 {C}
R78 P078 P077 {R}
C78 P078 0 {C}
R79 P079 P078 {R}
C79 P079 0 {C}
R80 P080 P079 {R}
C80 P080 0 {C}
R81 P081 P080 {R}
C81 P081 0 {C}
R82 P082 P081 {R}
C82 P082 0 {C}
R83 P083 P082 {R}
C83 P083 0 {C}
R84 P084 P083 {R}
C84 P084 0 {C}
R85 P085 P084 {R}
C85 P085 0 {C}
R86 P086 P085 {R}
C86 P086 0 {C}
R87 P087 P086 {R}
C87 P087 0 {C}
R88 P088 P087 {R}
C88 P088 0 {C}
R89 P089 P088 {R}
C89 P089 0 {C}
R90 P090 P089 {R}
C90 P090 0 {C}
R91 P091 P090 {R}
C91 P091 0 {C}
R92 P092 P091 {R}
C92 P092 0 {C}
R93 P093 P092 {R}
C93 P093 0 {C}
R94 P094 P093 {R}
C94 P094 0 {C}
R95 P095 P094 {R}
C95 P095 0 {C}
R96 P096 P095 {R}
C96 P096 0 {C}
R97 P097 P096 {R}
C97 P097 0 {C}
R98 P098 P097 {R}
C98 P098 0 {C}
R99 P099 P098 {R}
C99 P099 0 {C}
R100 P100 P099 {R}
C100 P100 0 {C}
R101 P101 P100 {R}
C101 P101 0 {C}
R102 P102 P101 {R}
C102 P102 0 {C}
R103 P103 P102 {R}
C103 P103 0 {C}
R104 P104 P103 {R}
C104 P104 0 {C}
R105 P105 P104 {R}
C105 P105 0 {C}
R106 P106 P105 {R}
C106 P106 0 {C}
R107 P107 P106 {R}
C107 P107 0 {C}
R108 P108 P107 {R}
C108 P108 0 {C}
R109 P109 P108 {R}
C109 P109 0 {C}
R110 P110 P109 {R}
C110 P110 0 {C}
R111 P111 P110 {R}
C111 P111 0 {C}
R112 P112 P111 {R}
C112 P112 0 {C}
R113 P113 P112 {R}
C113 P113 0 {C}
R114 P114 P113 {R}
C114 P114 0 {C}
R115 P115 P114 {R}
C115 P115 0 {C}
R116 P116 P115 {R}
C116 P116 0 {C}
R117 P117 P116 {R}
C117 P117 0 {C}
R118 P118 P117 {R}
C118 P118 0 {C}
R119 P119 P118 {R}
C119 P119 0 {C}
R120 P120 P119 {R}
C120 P120 0 {C}
R121 P121 P120 {R}
C121 P121 0 {C}
R122 P122 P121 {R}
C122 P122 0 {C}
R123 P123 P122 {R}
C123 P123 0 {C}
R124 P124 P123 {R}
C124 P124 0 {C}
R125 P125 P124 {R}
C125 P125 0 {C}
R126 P126 P125 {R}
C126 P126 0 {C}
R127 P127 P126 {R}
C127 P127 0 {C}
R128 N001 P127 {R}
C128 N001 0 {C}
R129 P128 N001 {R}
C129 P128 0 {C}
R130 P129 P128 {R}
C130 P129 0 {C}
R131 P130 P129 {R}
C131 P130 0 {C}
R132 P131 P130 {R}
C132 P131 0 {C}
R133 P132 P131 {R}
C133 P132 0 {C}
R134 P133 P132 {R}
C134 P133 0 {C}
R135 P134 P133 {R}
C135 P134 0 {C}
R136 P135 P134 {R}
C136 P135 0 {C}
R137 P136 P135 {R}
C137 P136 0 {C}
R138 P137 P136 {R}
C138 P137 0 {C}
R139 P138 P137 {R}
C139 P138 0 {C}
R140 P139 P138 {R}
C140 P139 0 {C}
R141 P140 P139 {R}
C141 P140 0 {C}
R142 P141 P140 {R}
C142 P141 0 {C}
R143 P142 P141 {R}
C143 P142 0 {C}
R144 P143 P142 {R}
C144 P143 0 {C}
R145 P144 P143 {R}
C145 P144 0 {C}
R146 P145 P144 {R}
C146 P145 0 {C}
R147 P146 P145 {R}
C147 P146 0 {C}
R148 P147 P146 {R}
C148 P147 0 {C}
R149 P148 P147 {R}
C149 P148 0 {C}
R150 P149 P148 {R}
C150 P149 0 {C}
R151 P150 P149 {R}
C151 P150 0 {C}
R152 P151 P150 {R}
C152 P151 0 {C}
R153 P152 P151 {R}
C153 P152 0 {C}
R154 P153 P152 {R}
C154 P153 0 {C}
R155 P154 P153 {R}
C155 P154 0 {C}
R156 P155 P154 {R}
C156 P155 0 {C}
R157 P156 P155 {R}
C157 P156 0 {C}
R158 P157 P156 {R}
C158 P157 0 {C}
R159 P158 P157 {R}
C159 P158 0 {C}
R160 P159 P158 {R}
C160 P159 0 {C}
R161 P160 P159 {R}
C161 P160 0 {C}
R162 P161 P160 {R}
C162 P161 0 {C}
R163 P162 P161 {R}
C163 P162 0 {C}
R164 P163 P162 {R}
C164 P163 0 {C}
R165 P164 P163 {R}
C165 P164 0 {C}
R166 P165 P164 {R}
C166 P165 0 {C}
R167 P166 P165 {R}
C167 P166 0 {C}
R168 P167 P166 {R}
C168 P167 0 {C}
R169 P168 P167 {R}
C169 P168 0 {C}
R170 P169 P168 {R}
C170 P169 0 {C}
R171 P170 P169 {R}
C171 P170 0 {C}
R172 P171 P170 {R}
C172 P171 0 {C}
R173 P172 P171 {R}
C173 P172 0 {C}
R174 P173 P172 {R}
C174 P173 0 {C}
R175 P174 P173 {R}
C175 P174 0 {C}
R176 P175 P174 {R}
C176 P175 0 {C}
R177 P176 P175 {R}
C177 P176 0 {C}
R178 P177 P176 {R}
C178 P177 0 {C}
R179 P178 P177 {R}
C179 P178 0 {C}
R180 P179 P178 {R}
C180 P179 0 {C}
R181 P180 P179 {R}
C181 P180 0 {C}
R182 P181 P180 {R}
C182 P181 0 {C}
R183 P182 P181 {R}
C183 P182 0 {C}
R184 P183 P182 {R}
C184 P183 0 {C}
R185 P184 P183 {R}
C185 P184 0 {C}
R186 P185 P184 {R}
C186 P185 0 {C}
R187 P186 P185 {R}
C187 P186 0 {C}
R188 P187 P186 {R}
C188 P187 0 {C}
R189 P188 P187 {R}
C189 P188 0 {C}
R190 P189 P188 {R}
C190 P189 0 {C}
R191 P190 P189 {R}
C191 P190 0 {C}
R192 P191 P190 {R}
C192 P191 0 {C}
R193 P192 P191 {R}
C193 P192 0 {C}
R194 P193 P192 {R}
C194 P193 0 {C}
R195 P194 P193 {R}
C195 P194 0 {C}
R196 P195 P194 {R}
C196 P195 0 {C}
R197 P196 P195 {R}
C197 P196 0 {C}
R198 P197 P196 {R}
C198 P197 0 {C}
R199 P198 P197 {R}
C199 P198 0 {C}
R200 P199 P198 {R}
C200 P199 0 {C}
R201 P200 P199 {R}
C201 P200 0 {C}
R202 P201 P200 {R}
C202 P201 0 {C}
R203 P202 P201 {R}
C203 P202 0 {C}
R204 P203 P202 {R}
C204 P203 0 {C}
R205 P204 P203 {R}
C205 P204 0 {C}
R206 P205 P204 {R}
C206 P205 0 {C}
R207 P206 P205 {R}
C207 P206 0 {C}
R208 P207 P206 {R}
C208 P207 0 {C}
R209 P208 P207 {R}
C209 P208 0 {C}
R210 P209 P208 {R}
C210 P209 0 {C}
R211 P210 P209 {R}
C211 P210 0 {C}
R212 P211 P210 {R}
C212 P211 0 {C}
R213 P212 P211 {R}
C213 P212 0 {C}
R214 P213 P212 {R}
C214 P213 0 {C}
R215 P214 P213 {R}
C215 P214 0 {C}
R216 P215 P214 {R}
C216 P215 0 {C}
R217 P216 P215 {R}
C217 P216 0 {C}
R218 P217 P216 {R}
C218 P217 0 {C}
R219 P218 P217 {R}
C219 P218 0 {C}
R220 P219 P218 {R}
C220 P219 0 {C}
R221 P220 P219 {R}
C221 P220 0 {C}
R222 P221 P220 {R}
C222 P221 0 {C}
R223 P222 P221 {R}
C223 P222 0 {C}
R224 P223 P222 {R}
C224 P223 0 {C}
R225 P224 P223 {R}
C225 P224 0 {C}
R226 P225 P224 {R}
C226 P225 0 {C}
R227 P226 P225 {R}
C227 P226 0 {C}
R228 P227 P226 {R}
C228 P227 0 {C}
R229 P228 P227 {R}
C229 P228 0 {C}
R230 P229 P228 {R}
C230 P229 0 {C}
R231 P230 P229 {R}
C231 P230 0 {C}
R232 P231 P230 {R}
C232 P231 0 {C}
R233 P232 P231 {R}
C233 P232 0 {C}
R234 P233 P232 {R}
C234 P233 0 {C}
R235 P234 P233 {R}
C235 P234 0 {C}
R236 P235 P234 {R}
C236 P235 0 {C}
R237 P236 P235 {R}
C237 P236 0 {C}
R238 P237 P236 {R}
C238 P237 0 {C}
R239 P238 P237 {R}
C239 P238 0 {C}
R240 P239 P238 {R}
C240 P239 0 {C}
R241 P240 P239 {R}
C241 P240 0 {C}
R242 P241 P240 {R}
C242 P241 0 {C}
R243 P242 P241 {R}
C243 P242 0 {C}
R244 P243 P242 {R}
C244 P243 0 {C}
R245 P244 P243 {R}
C245 P244 0 {C}
R246 P245 P244 {R}
C246 P245 0 {C}
R247 P246 P245 {R}
C247 P246 0 {C}
R248 P247 P246 {R}
C248 P247 0 {C}
R249 P248 P247 {R}
C249 P248 0 {C}
R250 P249 P248 {R}
C250 P249 0 {C}
R251 P250 P249 {R}
C251 P250 0 {C}
R252 P251 P250 {R}
C252 P251 0 {C}
R253 P252 P251 {R}
C253 P252 0 {C}
R254 P253 P252 {R}
C254 P253 0 {C}
R255 P254 P253 {R}
C255 P254 0 {C}
R256 N002 P254 {R}
C256 N002 0 {C}
R257 P255 N002 {R}
C257 P255 0 {C}
R258 P256 P255 {R}
C258 P256 0 {C}
R259 P257 P256 {R}
C259 P257 0 {C}
R260 P258 P257 {R}
C260 P258 0 {C}
R261 P259 P258 {R}
C261 P259 0 {C}
R262 P260 P259 {R}
C262 P260 0 {C}
R263 P261 P260 {R}
C263 P261 0 {C}
R264 P262 P261 {R}
C264 P262 0 {C}
R265 P263 P262 {R}
C265 P263 0 {C}
R266 P264 P263 {R}
C266 P264 0 {C}
R267 P265 P264 {R}
C267 P265 0 {C}
R268 P266 P265 {R}
C268 P266 0 {C}
R269 P267 P266 {R}
C269 P267 0 {C}
R270 P268 P267 {R}
C270 P268 0 {C}
R271 P269 P268 {R}
C271 P269 0 {C}
R272 P270 P269 {R}
C272 P270 0 {C}
R273 P271 P270 {R}
C273 P271 0 {C}
R274 P272 P271 {R}
C274 P272 0 {C}
R275 P273 P272 {R}
C275 P273 0 {C}
R276 P274 P273 {R}
C276 P274 0 {C}
R277 P275 P274 {R}
C277 P275 0 {C}
R278 P276 P275 {R}
C278 P276 0 {C}
R279 P277 P276 {R}
C279 P277 0 {C}
R280 P278 P277 {R}
C280 P278 0 {C}
R281 P279 P278 {R}
C281 P279 0 {C}
R282 P280 P279 {R}
C282 P280 0 {C}
R283 P281 P280 {R}
C283 P281 0 {C}
R284 P282 P281 {R}
C284 P282 0 {C}
R285 P283 P282 {R}
C285 P283 0 {C}
R286 P284 P283 {R}
C286 P284 0 {C}
R287 P285 P284 {R}
C287 P285 0 {C}
R288 P286 P285 {R}
C288 P286 0 {C}
R289 P287 P286 {R}
C289 P287 0 {C}
R290 P288 P287 {R}
C290 P288 0 {C}
R291 P289 P288 {R}
C291 P289 0 {C}
R292 P290 P289 {R}
C292 P290 0 {C}
R293 P291 P290 {R}
C293 P291 0 {C}
R294 P292 P291 {R}
C294 P292 0 {C}
R295 P293 P292 {R}
C295 P293 0 {C}
R296 P294 P293 {R}
C296 P294 0 {C}
R297 P295 P294 {R}
C297 P295 0 {C}
R298 P296 P295 {R}
C298 P296 0 {C}
R299 P297 P296 {R}
C299 P297 0 {C}
R300 P298 P297 {R}
C300 P298 0 {C}
R301 P299 P298 {R}
C301 P299 0 {C}
R302 P300 P299 {R}
C302 P300 0 {C}
R303 P301 P300 {R}
C303 P301 0 {C}
R304 P302 P301 {R}
C304 P302 0 {C}
R305 P303 P302 {R}
C305 P303 0 {C}
R306 P304 P303 {R}
C306 P304 0 {C}
R307 P305 P304 {R}
C307 P305 0 {C}
R308 P306 P305 {R}
C308 P306 0 {C}
R309 P307 P306 {R}
C309 P307 0 {C}
R310 P308 P307 {R}
C310 P308 0 {C}
R311 P309 P308 {R}
C311 P309 0 {C}
R312 P310 P309 {R}
C312 P310 0 {C}
R313 P311 P310 {R}
C313 P311 0 {C}
R314 P312 P311 {R}
C314 P312 0 {C}
R315 P313 P312 {R}
C315 P313 0 {C}
R316 P314 P313 {R}
C316 P314 0 {C}
R317 P315 P314 {R}
C317 P315 0 {C}
R318 P316 P315 {R}
C318 P316 0 {C}
R319 P317 P316 {R}
C319 P317 0 {C}
R320 P318 P317 {R}
C320 P318 0 {C}
R321 P319 P318 {R}
C321 P319 0 {C}
R322 P320 P319 {R}
C322 P320 0 {C}
R323 P321 P320 {R}
C323 P321 0 {C}
R324 P322 P321 {R}
C324 P322 0 {C}
R325 P323 P322 {R}
C325 P323 0 {C}
R326 P324 P323 {R}
C326 P324 0 {C}
R327 P325 P324 {R}
C327 P325 0 {C}
R328 P326 P325 {R}
C328 P326 0 {C}
R329 P327 P326 {R}
C329 P327 0 {C}
R330 P328 P327 {R}
C330 P328 0 {C}
R331 P329 P328 {R}
C331 P329 0 {C}
R332 P330 P329 {R}
C332 P330 0 {C}
R333 P331 P330 {R}
C333 P331 0 {C}
R334 P332 P331 {R}
C334 P332 0 {C}
R335 P333 P332 {R}
C335 P333 0 {C}
R336 P334 P333 {R}
C336 P334 0 {C}
R337 P335 P334 {R}
C337 P335 0 {C}
R338 P336 P335 {R}
C338 P336 0 {C}
R339 P337 P336 {R}
C339 P337 0 {C}
R340 P338 P337 {R}
C340 P338 0 {C}
R341 P339 P338 {R}
C341 P339 0 {C}
R342 P340 P339 {R}
C342 P340 0 {C}
R343 P341 P340 {R}
C343 P341 0 {C}
R344 P342 P341 {R}
C344 P342 0 {C}
R345 P343 P342 {R}
C345 P343 0 {C}
R346 P344 P343 {R}
C346 P344 0 {C}
R347 P345 P344 {R}
C347 P345 0 {C}
R348 P346 P345 {R}
C348 P346 0 {C}
R349 P347 P346 {R}
C349 P347 0 {C}
R350 P348 P347 {R}
C350 P348 0 {C}
R351 P349 P348 {R}
C351 P349 0 {C}
R352 P350 P349 {R}
C352 P350 0 {C}
R353 P351 P350 {R}
C353 P351 0 {C}
R354 P352 P351 {R}
C354 P352 0 {C}
R355 P353 P352 {R}
C355 P353 0 {C}
R356 P354 P353 {R}
C356 P354 0 {C}
R357 P355 P354 {R}
C357 P355 0 {C}
R358 P356 P355 {R}
C358 P356 0 {C}
R359 P357 P356 {R}
C359 P357 0 {C}
R360 P358 P357 {R}
C360 P358 0 {C}
R361 P359 P358 {R}
C361 P359 0 {C}
R362 P360 P359 {R}
C362 P360 0 {C}
R363 P361 P360 {R}
C363 P361 0 {C}
R364 P362 P361 {R}
C364 P362 0 {C}
R365 P363 P362 {R}
C365 P363 0 {C}
R366 P364 P363 {R}
C366 P364 0 {C}
R367 P365 P364 {R}
C367 P365 0 {C}
R368 P366 P365 {R}
C368 P366 0 {C}
R369 P367 P366 {R}
C369 P367 0 {C}
R370 P368 P367 {R}
C370 P368 0 {C}
R371 P369 P368 {R}
C371 P369 0 {C}
R372 P370 P369 {R}
C372 P370 0 {C}
R373 P371 P370 {R}
C373 P371 0 {C}
R374 P372 P371 {R}
C374 P372 0 {C}
R375 P373 P372 {R}
C375 P373 0 {C}
R376 P374 P373 {R}
C376 P374 0 {C}
R377 P375 P374 {R}
C377 P375 0 {C}
R378 P376 P375 {R}
C378 P376 0 {C}
R379 P377 P376 {R}
C379 P377 0 {C}
R380 P378 P377 {R}
C380 P378 0 {C}
R381 P379 P378 {R}
C381 P379 0 {C}
R382 P380 P379 {R}
C382 P380 0 {C}
R383 P381 P380 {R}
C383 P381 0 {C}
R384 N003 P381 {R}
R385 P382 N003 {R}
C385 P382 0 {C}
R386 P383 P382 {R}
C386 P383 0 {C}
R387 P384 P383 {R}
C387 P384 0 {C}
R388 P385 P384 {R}
C388 P385 0 {C}
R389 P386 P385 {R}
C389 P386 0 {C}
R390 P387 P386 {R}
C390 P387 0 {C}
R391 P388 P387 {R}
C391 P388 0 {C}
R392 P389 P388 {R}
C392 P389 0 {C}
R393 P390 P389 {R}
C393 P390 0 {C}
R394 P391 P390 {R}
C394 P391 0 {C}
R395 P392 P391 {R}
C395 P392 0 {C}
R396 P393 P392 {R}
C396 P393 0 {C}
R397 P394 P393 {R}
C397 P394 0 {C}
R398 P395 P394 {R}
C398 P395 0 {C}
R399 P396 P395 {R}
C399 P396 0 {C}
R400 P397 P396 {R}
C400 P397 0 {C}
R401 P398 P397 {R}
C401 P398 0 {C}
R402 P399 P398 {R}
C402 P399 0 {C}
R403 P400 P399 {R}
C403 P400 0 {C}
R404 P401 P400 {R}
C404 P401 0 {C}
R405 P402 P401 {R}
C405 P402 0 {C}
R406 P403 P402 {R}
C406 P403 0 {C}
R407 P404 P403 {R}
C407 P404 0 {C}
R408 P405 P404 {R}
C408 P405 0 {C}
R409 P406 P405 {R}
C409 P406 0 {C}
R410 P407 P406 {R}
C410 P407 0 {C}
R411 P408 P407 {R}
C411 P408 0 {C}
R412 P409 P408 {R}
C412 P409 0 {C}
R413 P410 P409 {R}
C413 P410 0 {C}
R414 P411 P410 {R}
C414 P411 0 {C}
R415 P412 P411 {R}
C415 P412 0 {C}
R416 P413 P412 {R}
C416 P413 0 {C}
R417 P414 P413 {R}
C417 P414 0 {C}
R418 P415 P414 {R}
C418 P415 0 {C}
R419 P416 P415 {R}
C419 P416 0 {C}
R420 P417 P416 {R}
C420 P417 0 {C}
R421 P418 P417 {R}
C421 P418 0 {C}
R422 P419 P418 {R}
C422 P419 0 {C}
R423 P420 P419 {R}
C423 P420 0 {C}
R424 P421 P420 {R}
C424 P421 0 {C}
R425 P422 P421 {R}
C425 P422 0 {C}
R426 P423 P422 {R}
C426 P423 0 {C}
R427 P424 P423 {R}
C427 P424 0 {C}
R428 P425 P424 {R}
C428 P425 0 {C}
R429 P426 P425 {R}
C429 P426 0 {C}
R430 P427 P426 {R}
C430 P427 0 {C}
R431 P428 P427 {R}
C431 P428 0 {C}
R432 P429 P428 {R}
C432 P429 0 {C}
R433 P430 P429 {R}
C433 P430 0 {C}
R434 P431 P430 {R}
C434 P431 0 {C}
R435 P432 P431 {R}
C435 P432 0 {C}
R436 P433 P432 {R}
C436 P433 0 {C}
R437 P434 P433 {R}
C437 P434 0 {C}
R438 P435 P434 {R}
C438 P435 0 {C}
R439 P436 P435 {R}
C439 P436 0 {C}
R440 P437 P436 {R}
C440 P437 0 {C}
R441 P438 P437 {R}
C441 P438 0 {C}
R442 P439 P438 {R}
C442 P439 0 {C}
R443 P440 P439 {R}
C443 P440 0 {C}
R444 P441 P440 {R}
C444 P441 0 {C}
R445 P442 P441 {R}
C445 P442 0 {C}
R446 P443 P442 {R}
C446 P443 0 {C}
R447 P444 P443 {R}
C447 P444 0 {C}
R448 P445 P444 {R}
C448 P445 0 {C}
R449 P446 P445 {R}
C449 P446 0 {C}
R450 P447 P446 {R}
C450 P447 0 {C}
R451 P448 P447 {R}
C451 P448 0 {C}
R452 P449 P448 {R}
C452 P449 0 {C}
R453 P450 P449 {R}
C453 P450 0 {C}
R454 P451 P450 {R}
C454 P451 0 {C}
R455 P452 P451 {R}
C455 P452 0 {C}
R456 P453 P452 {R}
C456 P453 0 {C}
R457 P454 P453 {R}
C457 P454 0 {C}
R458 P455 P454 {R}
C458 P455 0 {C}
R459 P456 P455 {R}
C459 P456 0 {C}
R460 P457 P456 {R}
C460 P457 0 {C}
R461 P458 P457 {R}
C461 P458 0 {C}
R462 P459 P458 {R}
C462 P459 0 {C}
R463 P460 P459 {R}
C463 P460 0 {C}
R464 P461 P460 {R}
C464 P461 0 {C}
R465 P462 P461 {R}
C465 P462 0 {C}
R466 P463 P462 {R}
C466 P463 0 {C}
R467 P464 P463 {R}
C467 P464 0 {C}
R468 P465 P464 {R}
C468 P465 0 {C}
R469 P466 P465 {R}
C469 P466 0 {C}
R470 P467 P466 {R}
C470 P467 0 {C}
R471 P468 P467 {R}
C471 P468 0 {C}
R472 P469 P468 {R}
C472 P469 0 {C}
R473 P470 P469 {R}
C473 P470 0 {C}
R474 P471 P470 {R}
C474 P471 0 {C}
R475 P472 P471 {R}
C475 P472 0 {C}
R476 P473 P472 {R}
C476 P473 0 {C}
R477 P474 P473 {R}
C477 P474 0 {C}
R478 P475 P474 {R}
C478 P475 0 {C}
R479 P476 P475 {R}
C479 P476 0 {C}
R480 P477 P476 {R}
C480 P477 0 {C}
R481 P478 P477 {R}
C481 P478 0 {C}
R482 P479 P478 {R}
C482 P479 0 {C}
R483 P480 P479 {R}
C483 P480 0 {C}
R484 P481 P480 {R}
C484 P481 0 {C}
R485 P482 P481 {R}
C485 P482 0 {C}
R486 P483 P482 {R}
C486 P483 0 {C}
R487 P484 P483 {R}
C487 P484 0 {C}
R488 P485 P484 {R}
C488 P485 0 {C}
R489 P486 P485 {R}
C489 P486 0 {C}
R490 P487 P486 {R}
C490 P487 0 {C}
R491 P488 P487 {R}
C491 P488 0 {C}
R492 P489 P488 {R}
C492 P489 0 {C}
R493 P490 P489 {R}
C493 P490 0 {C}
R494 P491 P490 {R}
C494 P491 0 {C}
R495 P492 P491 {R}
C495 P492 0 {C}
R496 P493 P492 {R}
C496 P493 0 {C}
R497 P494 P493 {R}
C497 P494 0 {C}
R498 P495 P494 {R}
C498 P495 0 {C}
R499 P496 P495 {R}
C499 P496 0 {C}
R500 P497 P496 {R}
C500 P497 0 {C}
R501 P498 P497 {R}
C501 P498 0 {C}
R502 P499 P498 {R}
C502 P499 0 {C}
R503 P500 P499 {R}
C503 P500 0 {C}
R504 P501 P500 {R}
C504 P501 0 {C}
R505 P502 P501 {R}
C505 P502 0 {C}
R506 P503 P502 {R}
C506 P503 0 {C}
R507 P504 P503 {R}
C507 P504 0 {C}
R508 P505 P504 {R}
C508 P505 0 {C}
R509 P506 P505 {R}
C509 P506 0 {C}
R510 P507 P506 {R}
C510 P507 0 {C}
R511 P508 P507 {R}
C511 P508 0 {C}
R512 R P508 {R}
C512 R 0 {C}
C384 N003 0 {C}
.ends bitline

.model NMOS NMOS
.model PMOS PMOS
.lib standard.mos
.include ./transistor_model.pm
* Bitline to array0
* Bitline to array1
.tran 120ns uic
* Plot Eq, ra0, ra1, bitline0+1.25, bitline1+1.25, sense_n+2.5, and sense_p+3.75
* Word line in array 0
* Word line in array 1
* .step param X 0.0v 1.5v 0.1v
.param process_var=0.05
.step param run 1 10000 1
.param cell_cap={24fF * cell_cap_factor}
.param bitline_cap={70f}
* DRAM Circuit Parameters
.param access_tran_L={85nm*access_tran_L_factor}
.param access_tran_W={55nm*access_tran_W_factor}
.param bitline_R=R_per_cell*cells_per_BL
* ohm
.param R_per_cell=60
* Bitline Resistance
.param SA_nmos_L={160nm*SA_nmos_L_factor}
.param SA_nmos_W={1900nm*SA_nmos_W_factor}
.param SA_pmos_L={160nm*SA_pmos_L_factor}
.param SA_pmos_W={1330nm*SA_pmos_W_factor}
.param SA_eq_L=96.3n
.param SA_eq_W=541n
.param SA_nset_L={255nm*SA_nset_L_factor}
.param SA_nset_W={220nm*SA_nset_W_factor}
.param SA_pset_L={255nm*SA_pset_L_factor}
.param SA_pset_W={220nm*SA_pset_W_factor}
.param cells_per_BL=512
* Cell Array
* Sense Amp.
* Voltage
.param core_voltage=1.2V
.param wordline_voltage=2.5V
.param pv_modifier=0.5
.param plate_voltage={core_voltage*pv_modifier}
.param psense_act=1ns
.param nsense_act=1ns
* Wordline Activation
.param wl0_act=1.0
.param tech_node=7
* 1 -> 45 nm, 4 -> 32nm, 7 -> 22 nm, 9-> 16nm
* Technology Scaling
.param cell_cap_factor={0.95**tech_node}
.param bl_cap_factor={0.95**tech_node}
.param access_tran_L_factor={0.95**tech_node}
.param access_tran_W_factor={0.85**tech_node}
.param SA_nmos_L_factor={0.93**tech_node}
.param SA_nmos_W_factor={0.93**tech_node}
.param SA_pmos_L_factor={0.93**tech_node}
.param SA_pmos_W_factor={0.93**tech_node}
.param SA_nset_L_factor={0.93**tech_node}
.param SA_nset_W_factor={0.93**tech_node}
.param SA_pset_L_factor={0.93**tech_node}
.param SA_pset_W_factor={0.95**tech_node}
.param wordline_C={WL_C_per_cell*cells_per_LWL}
.param WL_C_per_cell=0.07fF
* Wordline Parasitics
.param cells_per_LWL=512
.param WL_R_per_cell=40ohm
.param wordline_R={WL_R_per_cell*cells_per_LWL}
.param WL_cap_factor={0.95**tech_node}
.param WL_res_factor={0.95**tech_node}
* .OPTIONS maxord=1
* .OPTIONS itl1=1000
* .OPTIONS itl2=1000
* .OPTIONS itl4=1000
.TEMP 85
.param SA_nWR_L = {70n*SA_nWR_L_factor}
.param SA_nWR_W = {840n*SA_nWR_W_factor}
.param SA_pWR_L = {70n*SA_pWR_L_factor}
.param SA_pWR_W = {840n*SA_pWR_W_factor}
.param SA_CSEL_L = {70n*SA_CSEL_L_factor}
.param SA_CSEL_W = {840n*SA_CSEL_L_factor}
.param SA_nWR_L_factor={0.93**tech_node}
.param SA_nWR_W_factor={0.93**tech_node}
.param SA_pWR_L_factor={0.93**tech_node}
.param SA_pWR_W_factor={0.93**tech_node}
.param SA_CSEL_L_factor={0.93**tech_node}
.param SA_CSEL_W_factor={0.93**tech_node}
.param ISO_L_factor=0.3
.param ISO_W_factor=10
* Vars
.param cell_init_voltage=0.66
.backanno
.end